# Altium project Модуль STM32F108VBT6.PrjPcb
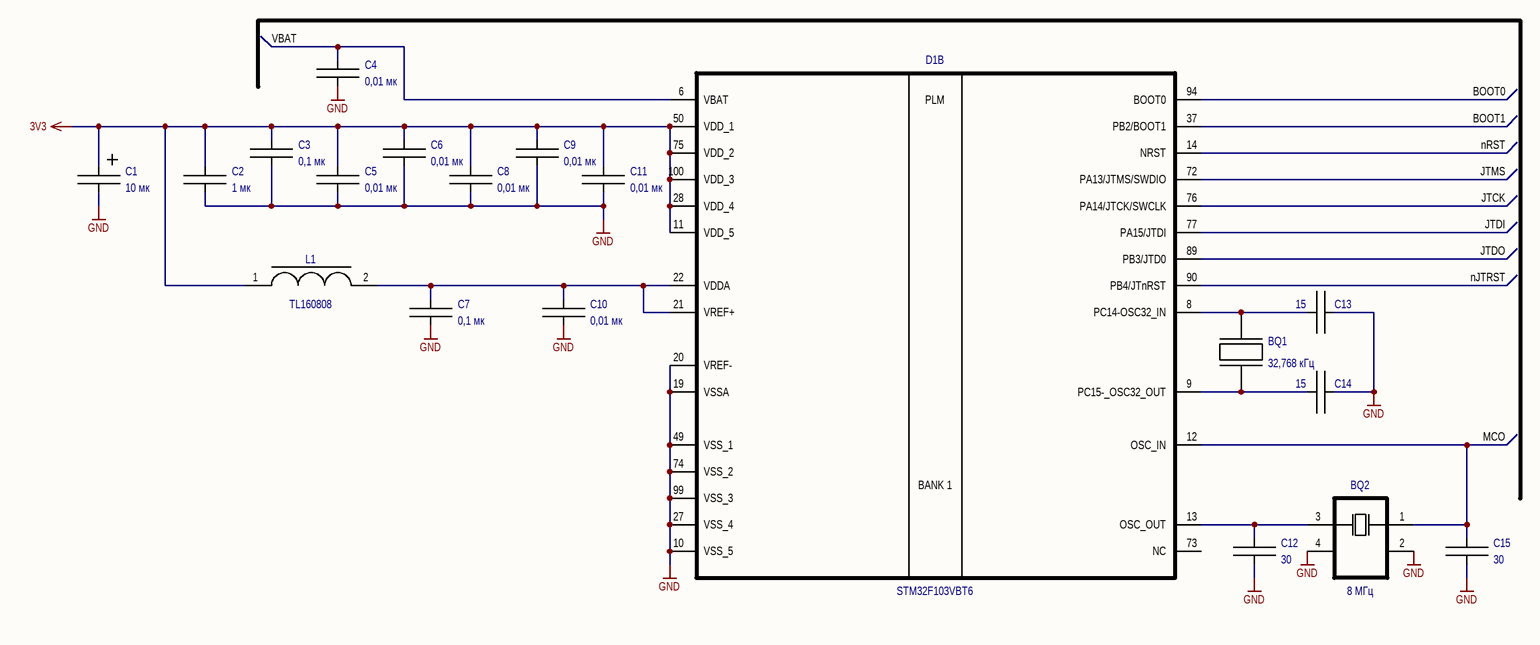
[diagram p0: Модуль STM32F108VBT6.SchDoc]
2 sheets, 20 parts. Net scope: global (net labels, ports and power ports of the same name join across sheets).
Board file: Модуль STM32F108VBT6.PcbDoc
Sheets:
  Модуль STM32F108VBT6.SchDoc
  Модуль STM32F108VBT6_2.SchDoc

## Sheet Модуль STM32F108VBT6.SchDoc
size 420 x 297 mm; SheetNumber: 1; SheetTotal: 1

### Parts
BQ1  value 32,768 кГц  [SMD3215_2P32768KHZ125PF10PPM]  (hidden comment: 3215)
BQ2  value 8 МГц  [SMD3225_4P20MHZ20PF10PPM]  (hidden comment: кварцевый резонатор_1)
C1  value 10 мк  [K53-68_3216(A)]  (hidden comment: A-case)
C2  value 1 мк  [K10-69B_2.0_1.25(0805)]  (hidden comment: 0805)
C3  value 0,1 мк  [K10-79_1.6_0.8(0603)]  (hidden comment: 0603)
C4  value 0,01 мк  [K10-79_1.6_0.8(0603)]  (hidden comment: 0603)
C5  value 0,01 мк  [K10-79_1.6_0.8(0603)]  (hidden comment: 0603)
C6  value 0,01 мк  [K10-79_1.6_0.8(0603)]  (hidden comment: 0603)
C7  value 0,1 мк  [K10-79_1.6_0.8(0603)]  (hidden comment: 0603)
C8  value 0,01 мк  [K10-79_1.6_0.8(0603)]  (hidden comment: 0603)
C9  value 0,01 мк  [K10-79_1.6_0.8(0603)]  (hidden comment: 0603)
C10  value 0,01 мк  [K10-79_1.6_0.8(0603)]  (hidden comment: 0603)
C11  value 0,01 мк  [K10-79_1.6_0.8(0603)]  (hidden comment: 0603)
C12  value 30  [K10-79_1.6_0.8(0603)]  (hidden comment: 0603)
C13  value 15  [K10-79_1.6_0.8(0603)]  (hidden comment: 0603)
C14  value 15  [K10-79_1.6_0.8(0603)]  (hidden comment: 0603)
C15  value 30  [K10-79_1.6_0.8(0603)]  (hidden comment: 0603)
D1  value STM32F103VBT6  [QFP50P1600X1600X160-100N]  (part B of 2)
L1  value TL160808  [742792651]  (hidden comment: 0603)

### Nets
3V3: C1.1 C2.2 C3.2 C5.2 C6.2 C8.2 C9.2 C11.2 D1.11(VDD_5) D1.28(VDD_4) D1.50(VDD_1) D1.75(VDD_2) D1.100(VDD_3) L1.1
GND: BQ2.2(GND) BQ2.4(GND) C1.2 C2.1 C3.1 C4.1 C5.1 C6.1 C7.1 C8.1 C9.1 C10.1 C11.1 C12.1 C13.1 C14.1 C15.1 D1.10(VSS_5) D1.19(VSSA) D1.20(VREF-) D1.27(VSS_4) D1.49(VSS_1) D1.74(VSS_2) D1.99(VSS_3)
BOOT0: D1.94(BOOT0)
BOOT1: D1.37(PB2/BOOT1)
JTCK: D1.76(PA14/JTCK/SWCLK)
JTDI: D1.77(PA15/JTDI)
JTDO: D1.89(PB3/JTD0)
JTMS: D1.72(PA13/JTMS/SWDIO)
MCO: BQ2.1 C15.2 D1.12(OSC_IN)
nJTRST: D1.90(PB4/JTnRST)
nRST: D1.14(NRST)
VBAT: C4.2 D1.6(VBAT)
NetBQ1_1: BQ1.1(IN) C13.2 D1.8(PC14-OSC32_IN)
NetBQ1_2: BQ1.2(GND) C14.2 D1.9(PC15-_OSC32_OUT)
NetBQ2_3: BQ2.3 C12.2 D1.13(OSC_OUT)
NetC7_2: C7.2 C10.2 D1.21(VREF+) D1.22(VDDA) L1.2

Not connected (* = marked no-connect by the designer): D1 73(NC)

### Notes on the sheet
- Перв.примен.
- Справ. №
- Подп. и дата
- Инв.№ дубл.
- Взам. инв. №
- Изм.
- Лист
- № докум.
- Подп.
- Дата
- Лит.
- Масса
- Масштаб
- Пров.
- Т.контр
- Разраб.
- Схема электрическая принципиальная
- 1
- Листов
- Инв № подл.
- Н.контр.
- Утв.
- Копировал
- Формат А3
- (in symbol STM32F103VBT6, part B) PLM; BANK 1

### Library data of the parts
BQ1 = кварцевый резонатор: PartNumber: 32,768 кГц 3215 SMD; Company: Mercury; Package: 3215
BQ2 = кварцевый резонатор_1: PartNumber: MQ-12.000-18; Company: Mercury; Package: 0705
C1 = C+: Company: *; Tolerance: *; Voltage: *; Type: *; PartNumber: *; Package: A-case
C2-C15 = C: Company: *; PartNumber: *; Tolerance: *; Voltage: *; Type: *
  C2: Package: 0805
  C3-C15: Package: 0603
D1 = STM32F103VBT6: Company: Xilinx; PurtNamber: XC6SLX25-2FGG484C; Package: LQFP-48
L1 = SH6028-5R0YLB: Company: ABC Electronics Group; CurrentMax: 2,4А; PartNumber: TL160808; Package: 0603

## Sheet Модуль STM32F108VBT6_2.SchDoc: Что-то
size 420 x 297 mm; ApprovedBy: Человек; CheckedBy: Человек; Author: Человек; DrawnBy: Человек; DocumentNumber: АЕСН.ХХХХХХ.ХХХЭ3; SheetNumber: x; SheetTotal: x; DocumentName: Sheet1.SCHDOC
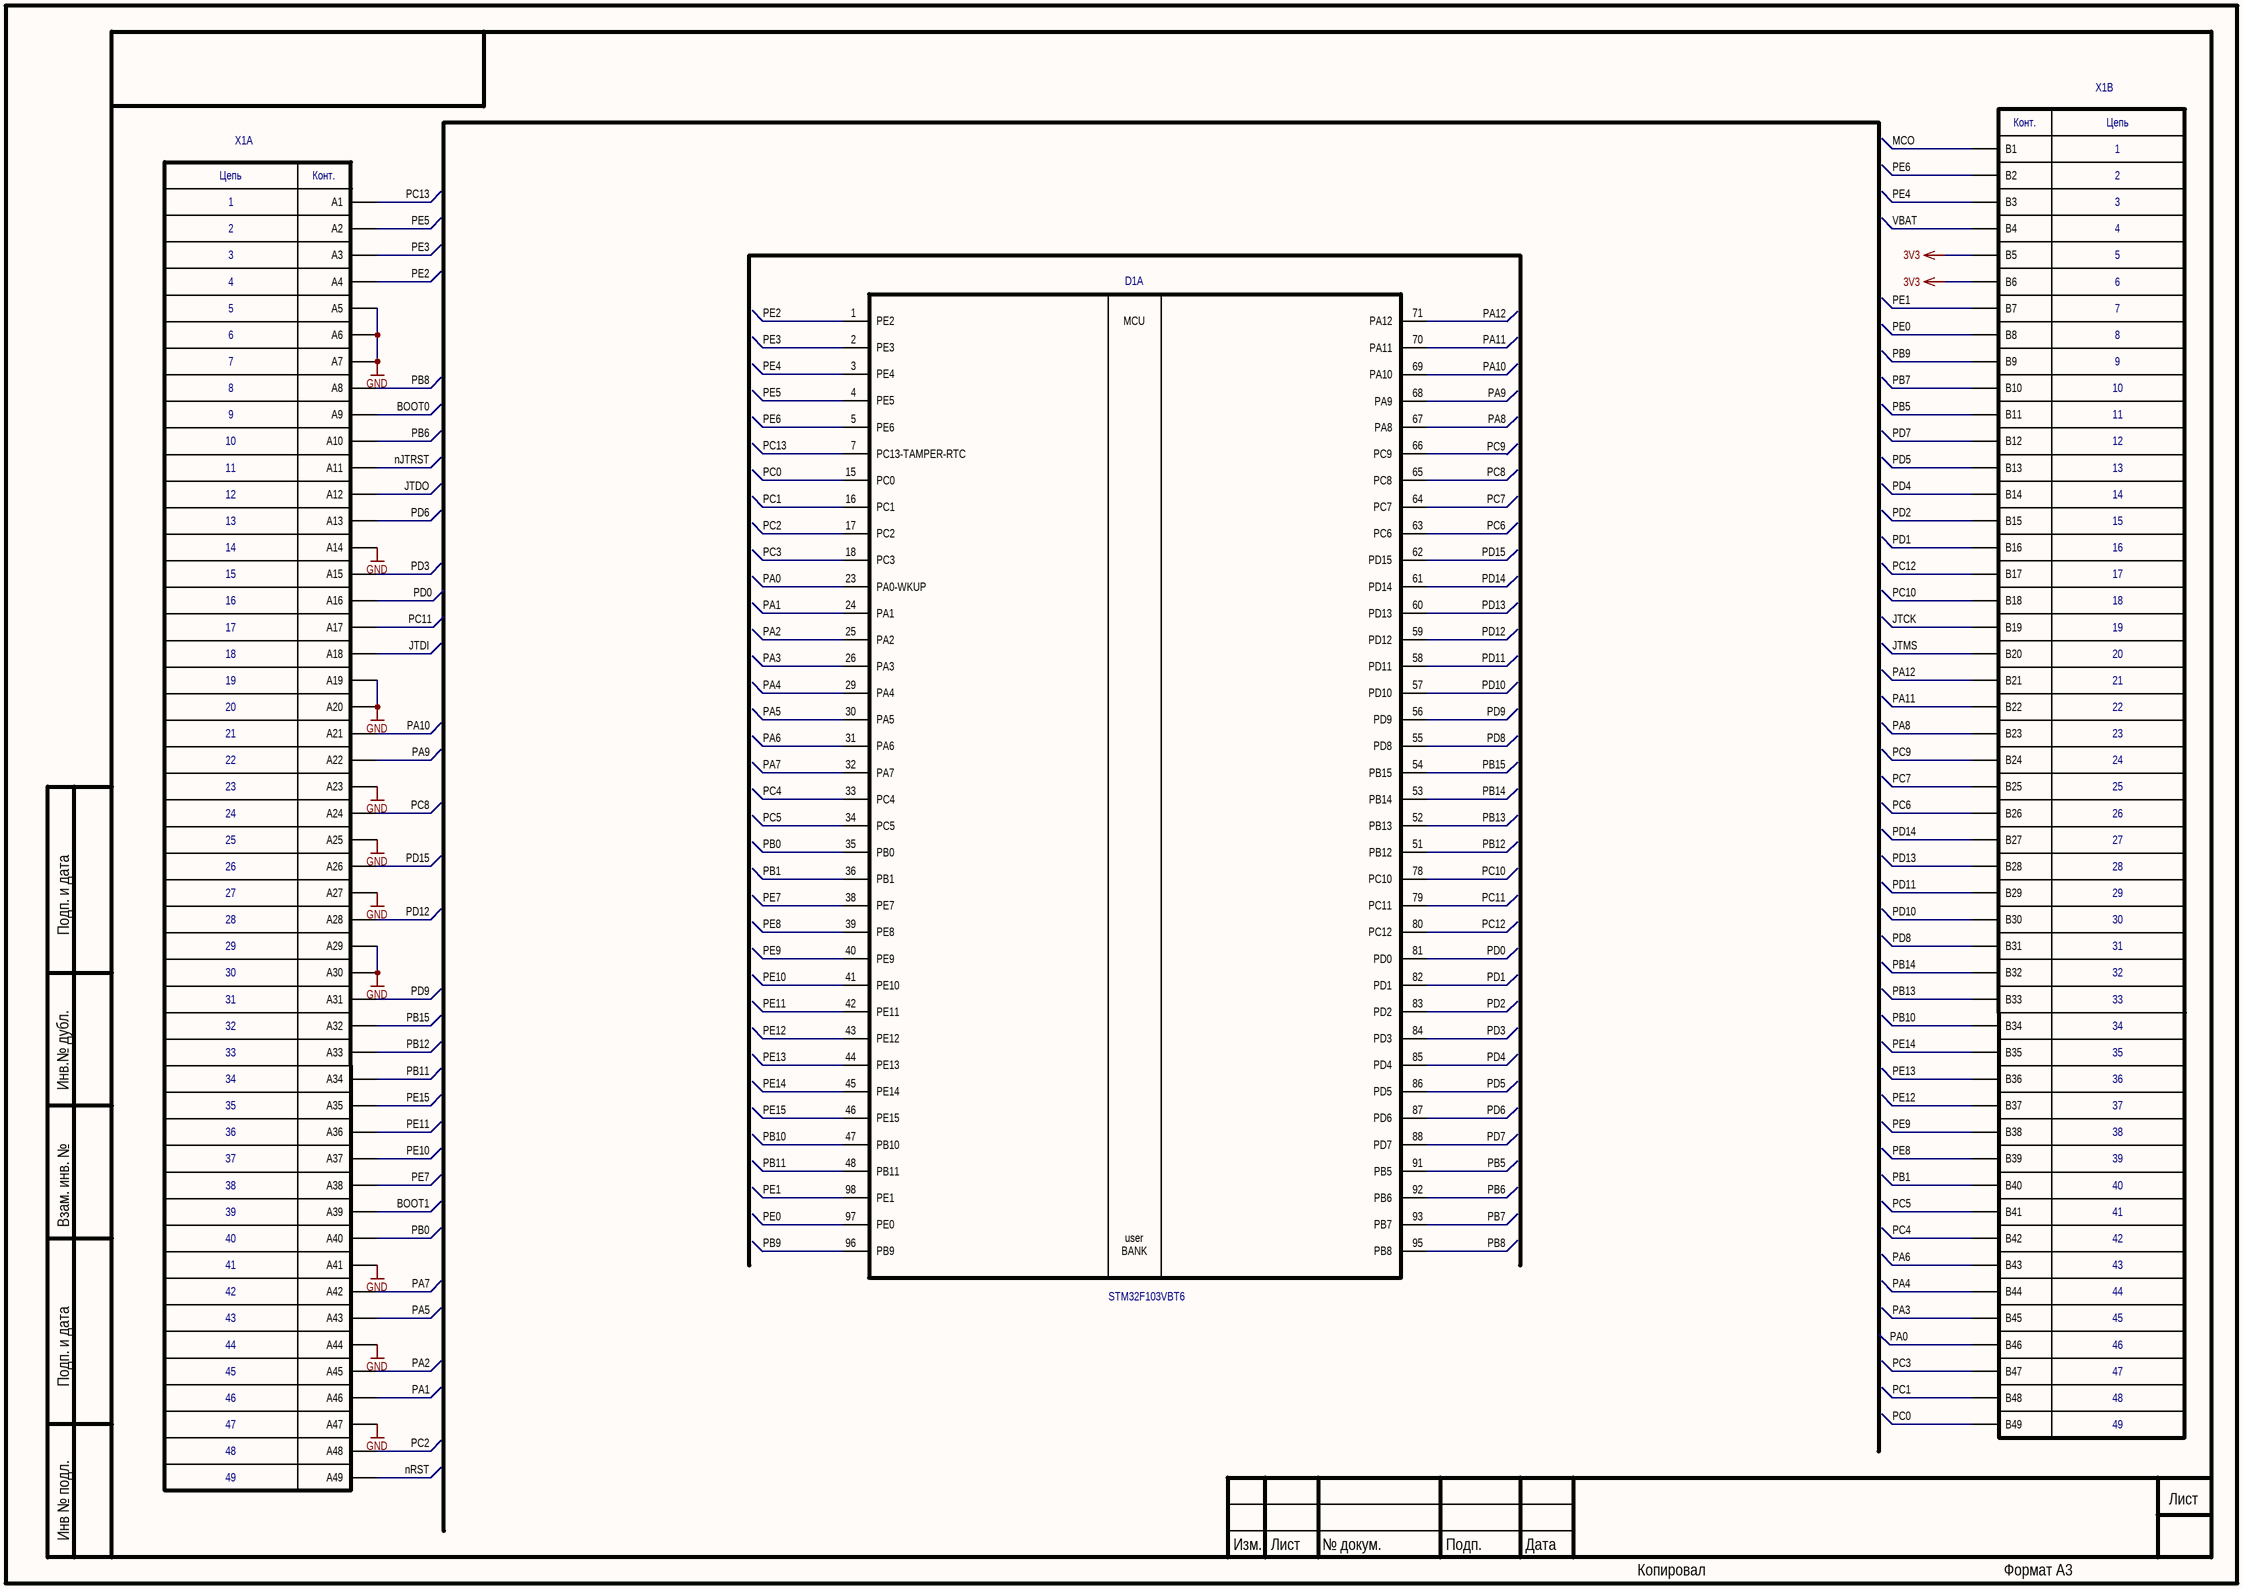
[diagram p1: Модуль STM32F108VBT6_2.SchDoc]

### Parts
D1  value STM32F103VBT6  [QFP50P1600X1600X160-100N]  (part A of 2)
X1  KONT_POLE_MEZ  [3113-112t_otv]  (value not drawn)  (parts A,B of 2)

### Nets
3V3: X1.B5 X1.B6
GND: X1.A5 X1.A6 X1.A7 X1.A14 X1.A19 X1.A20 X1.A23 X1.A25 X1.A27 X1.A29 X1.A30 X1.A41 X1.A44 X1.A47
BOOT0: X1.A9
BOOT1: X1.A39
JTCK: X1.B19
JTDI: X1.A18
JTDO: X1.A12
JTMS: X1.B20
MCO: X1.B1
nJTRST: X1.A11
nRST: X1.A49
PA0: D1.23(PA0-WKUP) X1.B46
PA1: D1.24(PA1) X1.A46
PA2: D1.25(PA2) X1.A45
PA3: D1.26(PA3) X1.B45
PA4: D1.29(PA4) X1.B44
PA5: D1.30(PA5) X1.A43
PA6: D1.31(PA6) X1.B43
PA7: D1.32(PA7) X1.A42
PA8: D1.67(PA8) X1.B23
PA9: D1.68(PA9) X1.A22
PA10: D1.69(PA10) X1.A21
PA11: D1.70(PA11) X1.B22
PA12: D1.71(PA12) X1.B21
PB0: D1.35(PB0) X1.A40
PB1: D1.36(PB1) X1.B40
PB5: D1.91(PB5) X1.B11
PB6: D1.92(PB6) X1.A10
PB7: D1.93(PB7) X1.B10
PB8: D1.95(PB8) X1.A8
PB9: D1.96(PB9) X1.B9
PB10: D1.47(PB10) X1.B34
PB11: D1.48(PB11) X1.A34
PB12: D1.51(PB12) X1.A33
PB13: D1.52(PB13) X1.B33
PB14: D1.53(PB14) X1.B32
PB15: D1.54(PB15) X1.A32
PC0: D1.15(PC0) X1.B49
PC1: D1.16(PC1) X1.B48
PC2: D1.17(PC2) X1.A48
PC3: D1.18(PC3) X1.B47
PC4: D1.33(PC4) X1.B42
PC5: D1.34(PC5) X1.B41
PC6: D1.63(PC6) X1.B26
PC7: D1.64(PC7) X1.B25
PC8: D1.65(PC8) X1.A24
PC9: D1.66(PC9) X1.B24
PC10: D1.78(PC10) X1.B18
PC11: D1.79(PC11) X1.A17
PC12: D1.80(PC12) X1.B17
PC13: D1.7(PC13-TAMPER-RTC) X1.A1
PD0: D1.81(PD0) X1.A16
PD1: D1.82(PD1) X1.B16
PD2: D1.83(PD2) X1.B15
PD3: D1.84(PD3) X1.A15
PD4: D1.85(PD4) X1.B14
PD5: D1.86(PD5) X1.B13
PD6: D1.87(PD6) X1.A13
PD7: D1.88(PD7) X1.B12
PD8: D1.55(PD8) X1.B31
PD9: D1.56(PD9) X1.A31
PD10: D1.57(PD10) X1.B30
PD11: D1.58(PD11) X1.B29
PD12: D1.59(PD12) X1.A28
PD13: D1.60(PD13) X1.B28
PD14: D1.61(PD14) X1.B27
PD15: D1.62(PD15) X1.A26
PE0: D1.97(PE0) X1.B8
PE1: D1.98(PE1) X1.B7
PE2: D1.1(PE2) X1.A4
PE3: D1.2(PE3) X1.A3
PE4: D1.3(PE4) X1.B3
PE5: D1.4(PE5) X1.A2
PE6: D1.5(PE6) X1.B2
PE7: D1.38(PE7) X1.A38
PE8: D1.39(PE8) X1.B39
PE9: D1.40(PE9) X1.B38
PE10: D1.41(PE10) X1.A37
PE11: D1.42(PE11) X1.A36
PE12: D1.43(PE12) X1.B37
PE13: D1.44(PE13) X1.B36
PE14: D1.45(PE14) X1.B35
PE15: D1.46(PE15) X1.A35
VBAT: X1.B4

### Notes on the sheet
- Подп. и дата
- Инв.№ дубл.
- Взам. инв. №
- Инв № подл.
- Изм.
- Лист
- № докум.
- Подп.
- Дата
- Копировал
- Формат А3
- (in symbol 3113-112T, part A) Цепь; Конт.; 1; 2; 3; 4; 5; 6; 7; 8; 9; 10; 11; 12; 13; 14; 15; 16; 17; 18; 19; 20; 21; 22; 23; 24; 25; 26; 27; 28; 29; 30; 31; 32; 33; 34; 35; 36; 37; 38; 39; 40; 41; 42; 43; 44; 45; 46; 47; 48; 49
- (in symbol 3113-112T, part B) Конт.; Цепь; 1; 2; 3; 4; 5; 6; 7; 8; 9; 10; 11; 12; 13; 14; 15; 16; 17; 18; 19; 20; 21; 22; 23; 24; 25; 26; 27; 28; 29; 30; 31; 32; 33; 34; 35; 36; 37; 38; 39; 40; 41; 42; 43; 44; 45; 46; 47; 48; 49
- (in symbol STM32F103VBT6, part A) MCU; user; BANK

### Library data of the parts
D1 = STM32F103VBT6: as D1 on sheet Модуль STM32F108VBT6; Package: LQFP-48
X1 = 3113-112T

## Nets that join several sheets
3V3: Модуль STM32F108VBT6 (14 pins), Модуль STM32F108VBT6_2 (X1.B5 X1.B6)
GND: Модуль STM32F108VBT6 (24 pins), Модуль STM32F108VBT6_2 (14 pins)
BOOT0: Модуль STM32F108VBT6 (D1.94), Модуль STM32F108VBT6_2 (X1.A9)
BOOT1: Модуль STM32F108VBT6 (D1.37), Модуль STM32F108VBT6_2 (X1.A39)
JTCK: Модуль STM32F108VBT6 (D1.76), Модуль STM32F108VBT6_2 (X1.B19)
JTDI: Модуль STM32F108VBT6 (D1.77), Модуль STM32F108VBT6_2 (X1.A18)
JTDO: Модуль STM32F108VBT6 (D1.89), Модуль STM32F108VBT6_2 (X1.A12)
JTMS: Модуль STM32F108VBT6 (D1.72), Модуль STM32F108VBT6_2 (X1.B20)
MCO: Модуль STM32F108VBT6 (BQ2.1 C15.2 D1.12), Модуль STM32F108VBT6_2 (X1.B1)
nJTRST: Модуль STM32F108VBT6 (D1.90), Модуль STM32F108VBT6_2 (X1.A11)
nRST: Модуль STM32F108VBT6 (D1.14), Модуль STM32F108VBT6_2 (X1.A49)
VBAT: Модуль STM32F108VBT6 (C4.2 D1.6), Модуль STM32F108VBT6_2 (X1.B4)